# Altium project STM32F407VGT6.PrjPcb (part 2 of 2)

## Sheet MCU.SchDoc
size A3
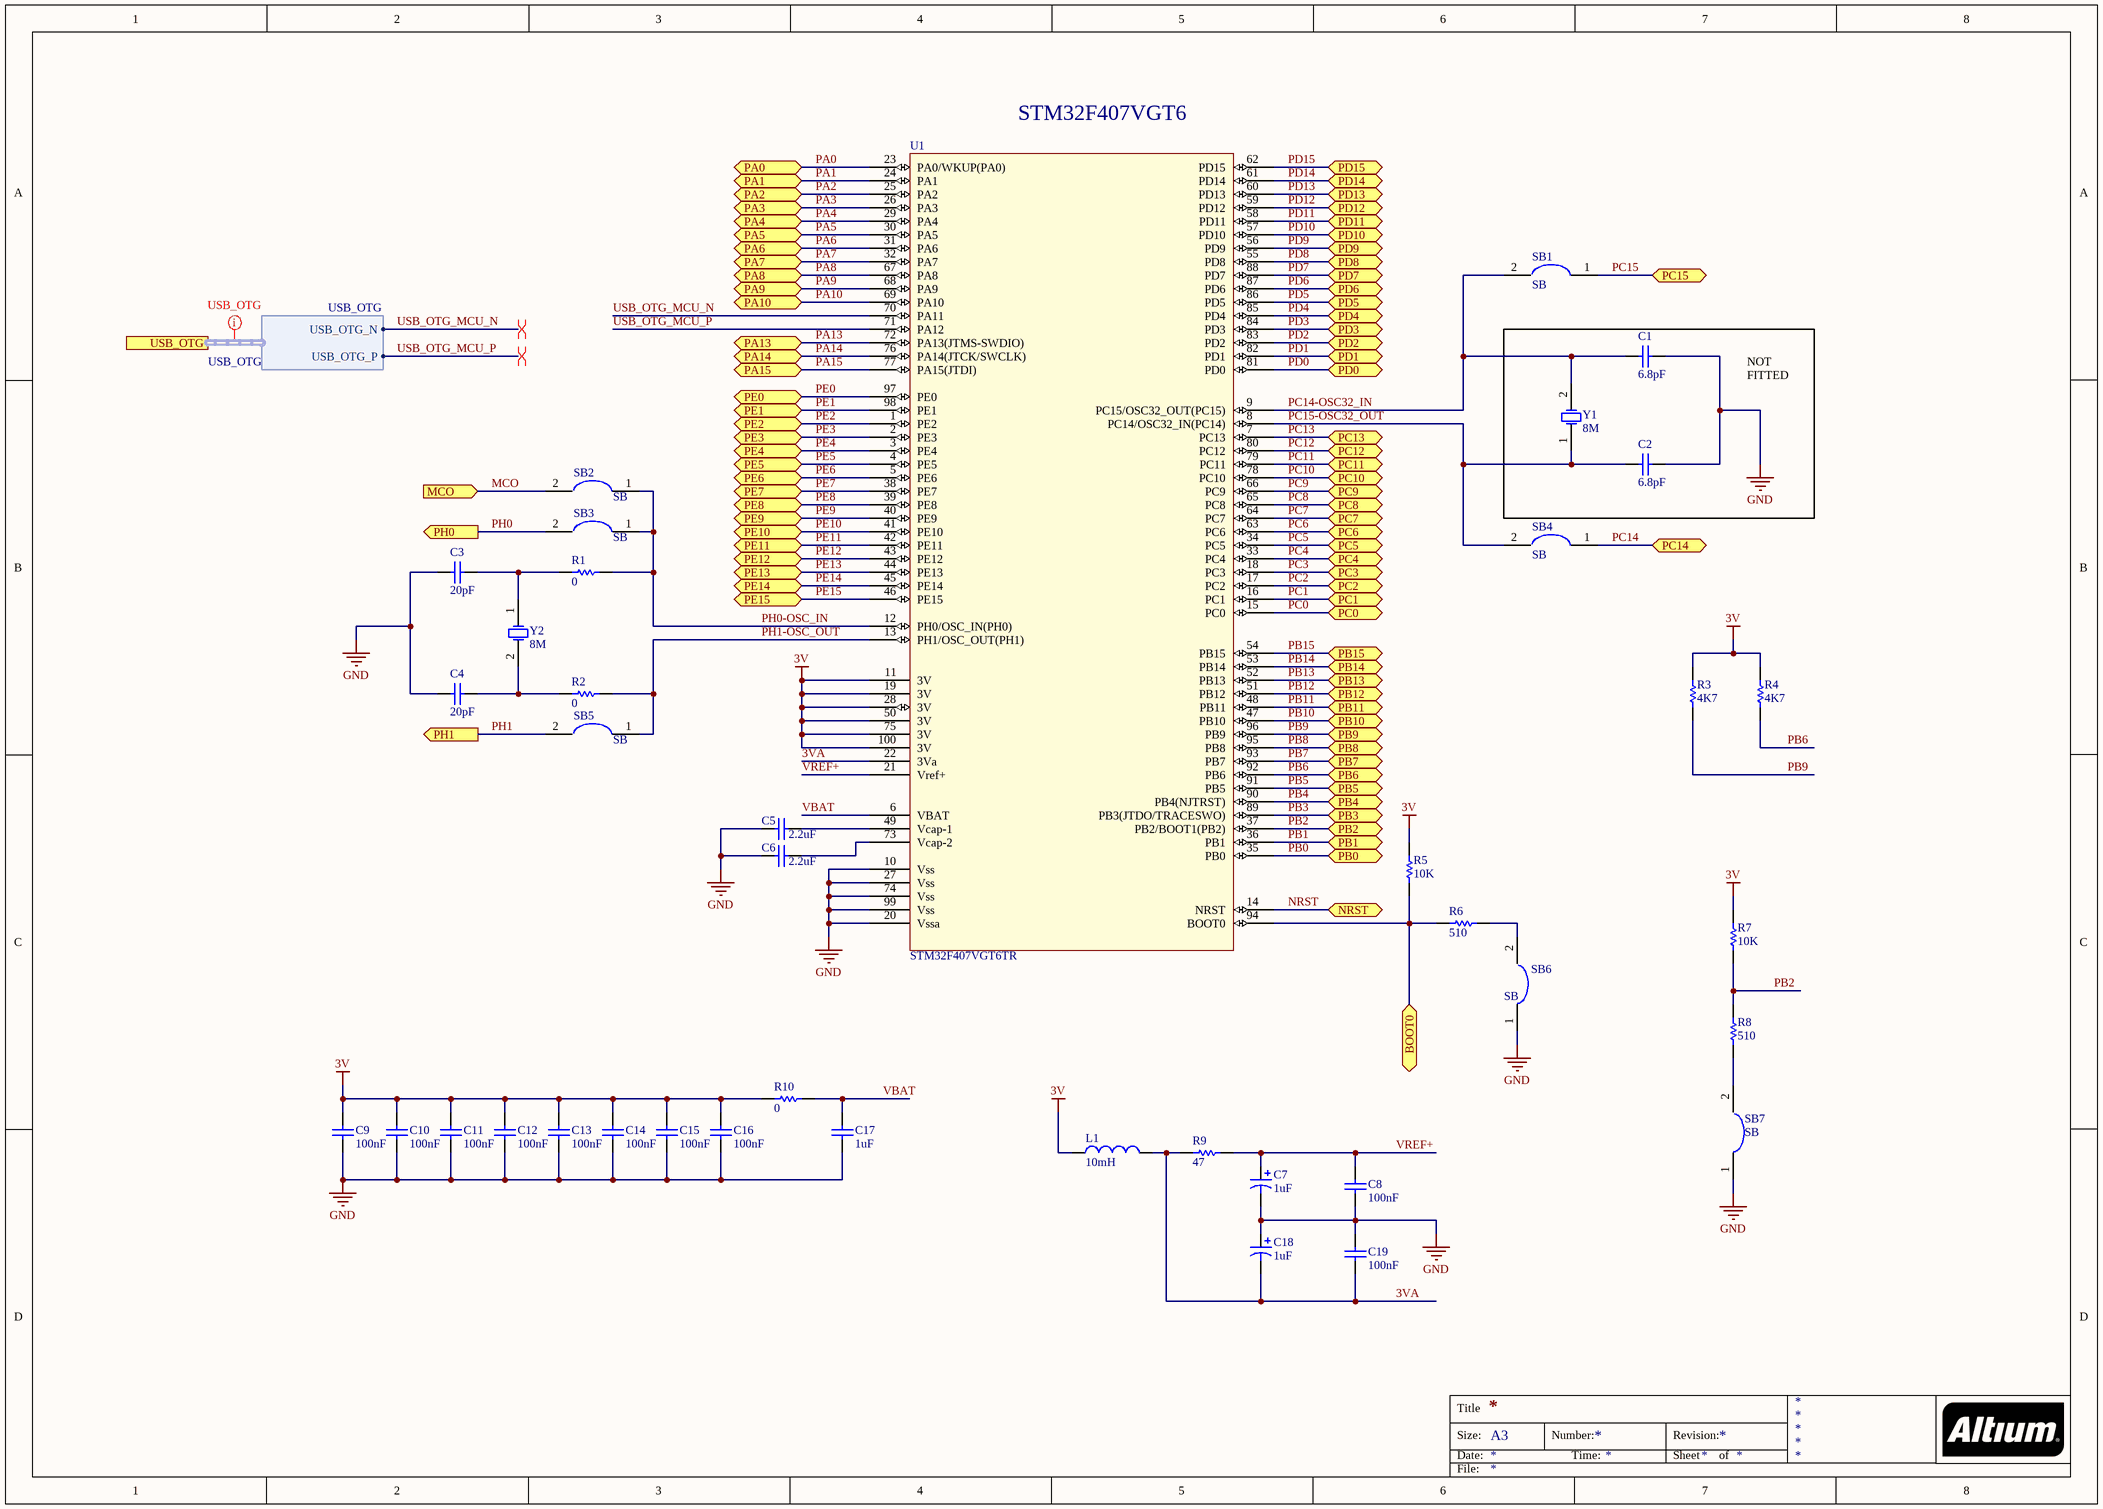
[diagram p5: MCU.SchDoc]

### Parts
C1  value 6.8pF  [CAPC0603B]  (hidden comment: Cap)
C2  value 6.8pF  [CAPC0603B]  (hidden comment: Cap)
C3  value 20pF  [CAPC0603B]  (hidden comment: Cap)
C4  value 20pF  [CAPC0603B]  (hidden comment: Cap)
C5  value 2.2uF  [CAPC0603B]  (hidden comment: Cap)
C6  value 2.2uF  [CAPC0603B]  (hidden comment: Cap)
C7  value 1uF  [TANTALUM CASE A_LEVEL B]  (hidden comment: Cap Pol1)
C8  value 100nF  [CAPC0603B]  (hidden comment: Cap)
C9  value 100nF  [CAPC0603B]  (hidden comment: Cap)
C10  value 100nF  [CAPC0603B]  (hidden comment: Cap)
C11  value 100nF  [CAPC0603B]  (hidden comment: Cap)
C12  value 100nF  [CAPC0603B]  (hidden comment: Cap)
C13  value 100nF  [CAPC0603B]  (hidden comment: Cap)
C14  value 100nF  [CAPC0603B]  (hidden comment: Cap)
C15  value 100nF  [CAPC0603B]  (hidden comment: Cap)
C16  value 100nF  [CAPC0603B]  (hidden comment: Cap)
C17  value 1uF  [CAPC0603B]  (hidden comment: Cap)
C18  value 1uF  [TANTALUM CASE A_LEVEL B]  (hidden comment: Cap Pol1)
C19  value 100nF  [CAPC0603B]  (hidden comment: Cap)
L1  value 10mH  [0402-A]  (hidden comment: Inductor)
R1  value 0  [RESC0603B]  (hidden comment: Res1)
R2  value 0  [RESC0603B]  (hidden comment: Res1)
R3  value 4K7  [RESC0402B]  (hidden comment: Res1)
R4  value 4K7  [RESC0402B]  (hidden comment: Res1)
R5  value 10K  [RESC0603B]  (hidden comment: Res1)
R6  value 510  [RESC0603B]  (hidden comment: Res1)
R7  value 10K  [RESC0603B]  (hidden comment: Res1)
R8  value 510  [RESC0603B]  (hidden comment: Res1)
R9  value 47  [RESC0603B]  (hidden comment: Res1)
R10  value 0  [RESC0603B]  (hidden comment: Res1)
SB1  SB  [SB]
SB2  SB  [SB]
SB3  SB  [SB]
SB4  SB  [SB]
SB5  SB  [SB]
SB6  SB  [SB]
SB7  SB  [SB]
U1  STM32F407VGT6TR  [LQFP100B]
Y1  8M  [HC-49S]
Y2  8M  [HC-49S]

### Ports
BOOT0 (bidir), MCO (in), NRST (bidir), PA0 (bidir), PA1 (bidir), PA2 (bidir), PA3 (bidir), PA4 (bidir), PA5 (bidir), PA6 (bidir), PA7 (bidir), PA8 (bidir), PA9 (bidir), PA10 (bidir), PA13 (bidir), PA14 (bidir), PA15 (bidir), PB0 (bidir), PB1 (bidir), PB2 (bidir), PB3 (bidir), PB4 (bidir), PB5 (bidir), PB6 (bidir), PB7 (bidir), PB8 (bidir), PB9 (bidir), PB10 (bidir), PB11 (bidir), PB12 (bidir), PB13 (bidir), PB14 (bidir), PB15 (bidir), PC0 (bidir), PC1 (bidir), PC2 (bidir), PC3 (bidir), PC4 (bidir), PC5 (bidir), PC6 (bidir), PC7 (bidir), PC8 (bidir), PC9 (bidir), PC10 (bidir), PC11 (bidir), PC12 (bidir), PC13 (bidir), PC14 (bidir), PC15 (bidir), PD0 (bidir), PD1 (bidir), PD2 (bidir), PD3 (bidir), PD4 (bidir), PD5 (bidir), PD6 (bidir), PD7 (bidir), PD8 (bidir), PD9 (bidir), PD10 (bidir), PD11 (bidir), PD12 (bidir), PD13 (bidir), PD14 (bidir), PD15 (bidir), PE0 (bidir), PE1 (bidir), PE2 (bidir), PE3 (bidir), PE4 (bidir), PE5 (bidir), PE6 (bidir), PE7 (bidir), PE8 (bidir), PE9 (bidir), PE10 (bidir), PE11 (bidir), PE12 (bidir), PE13 (bidir), PE14 (bidir), PE15 (bidir), PH0 (out), PH1 (out), USB_OTG (harness USB_OTG)

### Harnesses
USB_OTG: USB_OTG_N, USB_OTG_P

### Nets
3V: C9.2 C10.2 C11.2 C12.2 C13.2 C14.2 C15.2 C16.2 L1.1 R3.2 R4.2 R5.2 R7.2 R10.1 U1.11(3V) U1.19(3V) U1.28(3V) U1.50(3V) U1.75(3V) U1.100(3V)
GND: C1.2 C2.2 C3.1 C4.1 C5.2 C6.2 C7.2 C8.1 C9.1 C10.1 C11.1 C12.1 C13.1 C14.1 C15.1 C16.1 C17.2 C18.1 C19.2 SB6.1 SB7.1 U1.10(Vss) U1.20(Vssa) U1.27(Vss) U1.74(Vss) U1.99(Vss)
3VA: C18.2 C19.1 L1.2 R9.1 U1.22(3Va)
BOOT0: R5.1 R6.1 U1.94(BOOT0) ; port BOOT0
MCO: SB2.2 ; port MCO
NRST: U1.14(NRST) ; port NRST
PA0: U1.23(PA0/WKUP(PA0)) ; port PA0
PA1: U1.24(PA1) ; port PA1
PA2: U1.25(PA2) ; port PA2
PA3: U1.26(PA3) ; port PA3
PA4: U1.29(PA4) ; port PA4
PA5: U1.30(PA5) ; port PA5
PA6: U1.31(PA6) ; port PA6
PA7: U1.32(PA7) ; port PA7
PA8: U1.67(PA8) ; port PA8
PA9: U1.68(PA9) ; port PA9
PA10: U1.69(PA10) ; port PA10
PA13: U1.72(PA13(JTMS-SWDIO)) ; port PA13
PA14: U1.76(PA14(JTCK/SWCLK)) ; port PA14
PA15: U1.77(PA15(JTDI)) ; port PA15
PB0: U1.35(PB0) ; port PB0
PB1: U1.36(PB1) ; port PB1
PB2: R7.1 R8.1 U1.37(PB2/BOOT1(PB2)) ; port PB2
PB3: U1.89(PB3(JTDO/TRACESWO)) ; port PB3
PB4: U1.90(PB4(NJTRST)) ; port PB4
PB5: U1.91(PB5) ; port PB5
PB6: R4.1 U1.92(PB6) ; port PB6
PB7: U1.93(PB7) ; port PB7
PB8: U1.95(PB8) ; port PB8
PB9: R3.1 U1.96(PB9) ; port PB9
PB10: U1.47(PB10) ; port PB10
PB11: U1.48(PB11) ; port PB11
PB12: U1.51(PB12) ; port PB12
PB13: U1.52(PB13) ; port PB13
PB14: U1.53(PB14) ; port PB14
PB15: U1.54(PB15) ; port PB15
PC0: U1.15(PC0) ; port PC0
PC1: U1.16(PC1) ; port PC1
PC2: U1.17(PC2) ; port PC2
PC3: U1.18(PC3) ; port PC3
PC4: U1.33(PC4) ; port PC4
PC5: U1.34(PC5) ; port PC5
PC6: U1.63(PC6) ; port PC6
PC7: U1.64(PC7) ; port PC7
PC8: U1.65(PC8) ; port PC8
PC9: U1.66(PC9) ; port PC9
PC10: U1.78(PC10) ; port PC10
PC11: U1.79(PC11) ; port PC11
PC12: U1.80(PC12) ; port PC12
PC13: U1.7(PC13) ; port PC13
PC14: SB4.1 ; port PC14
PC14-OSC32_IN: C1.1 SB1.2 U1.9(PC15/OSC32_OUT(PC15)) Y1.2(OSC2)
PC15: SB1.1 ; port PC15
PC15-OSC32_OUT: C2.1 SB4.2 U1.8(PC14/OSC32_IN(PC14)) Y1.1(OSC1)
PD0: U1.81(PD0) ; port PD0
PD1: U1.82(PD1) ; port PD1
PD2: U1.83(PD2) ; port PD2
PD3: U1.84(PD3) ; port PD3
PD4: U1.85(PD4) ; port PD4
PD5: U1.86(PD5) ; port PD5
PD6: U1.87(PD6) ; port PD6
PD7: U1.88(PD7) ; port PD7
PD8: U1.55(PD8) ; port PD8
PD9: U1.56(PD9) ; port PD9
PD10: U1.57(PD10) ; port PD10
PD11: U1.58(PD11) ; port PD11
PD12: U1.59(PD12) ; port PD12
PD13: U1.60(PD13) ; port PD13
PD14: U1.61(PD14) ; port PD14
PD15: U1.62(PD15) ; port PD15
PE0: U1.97(PE0) ; port PE0
PE1: U1.98(PE1) ; port PE1
PE2: U1.1(PE2) ; port PE2
PE3: U1.2(PE3) ; port PE3
PE4: U1.3(PE4) ; port PE4
PE5: U1.4(PE5) ; port PE5
PE6: U1.5(PE6) ; port PE6
PE7: U1.38(PE7) ; port PE7
PE8: U1.39(PE8) ; port PE8
PE9: U1.40(PE9) ; port PE9
PE10: U1.41(PE10) ; port PE10
PE11: U1.42(PE11) ; port PE11
PE12: U1.43(PE12) ; port PE12
PE13: U1.44(PE13) ; port PE13
PE14: U1.45(PE14) ; port PE14
PE15: U1.46(PE15) ; port PE15
PH0: SB3.2 ; port PH0
PH0-OSC_IN: R1.2 SB2.1 SB3.1 U1.12(PH0/OSC_IN(PH0))
PH1: SB5.2 ; port PH1
PH1-OSC_OUT: R2.2 SB5.1 U1.13(PH1/OSC_OUT(PH1))
USB_OTG_MCU_N: U1.70(PA11) ; port USB_OTG.USB_OTG_N
USB_OTG_MCU_P: U1.71(PA12) ; port USB_OTG.USB_OTG_P
VBAT: C17.1 R10.2 U1.6(VBAT)
VREF+: C7.1 C8.2 R9.2 U1.21(Vref+)
NetC3_2: C3.2 R1.1 Y2.1(OSC1)
NetC4_2: C4.2 R2.1 Y2.2(OSC2)
NetC5_1: C5.1 U1.49(Vcap-1)
NetC6_1: C6.1 U1.73(Vcap-2)
NetR6_2: R6.2 SB6.2
NetR8_2: R8.2 SB7.2

### Layout directives
differential pair: USB_OTG_MCU_N, USB_OTG_MCU_P
net class USB_OTG: (no net found under the mark)

### Notes on the sheet
- (near U1) STM32F407VGT6
- NOT
- FITTED
- Title
- Size:
- Date:
- A3
- Number:
- Time:
- Revision:
- Sheet
- of
- File:

### Library data of the parts
C1 C2 = Cap_1: Capacitor; Published: 8-Jun-2000; LatestRevisionDate: 17-Jul-2002; LatestRevisionNote: Re-released for DXP Platform.; PackageReference: RAD-0.3; Publisher: Altium Limited; PackageDescription: Radial Cap, Thru-Hole; 2 Leads; 0.3 in Pin Spacing
C3 C4 = Cap: Capacitor; Published: 8-Jun-2000; LatestRevisionDate: 17-Jul-2002; LatestRevisionNote: Re-released for DXP Platform.; PackageReference: RAD-0.3; Publisher: Altium Limited; PackageDescription: Radial Cap, Thru-Hole; 2 Leads; 0.3 in Pin Spacing
C5 C6 = Cap_2: Capacitor; Published: 8-Jun-2000; LatestRevisionDate: 17-Jul-2002; LatestRevisionNote: Re-released for DXP Platform.; PackageReference: RAD-0.3; Publisher: Altium Limited; PackageDescription: Radial Cap, Thru-Hole; 2 Leads; 0.3 in Pin Spacing
C7 C18 = Cap Pol1: Polarized Capacitor (Radial); Published: 8-Jun-2000; LatestRevisionDate: 17-Jul-2002; LatestRevisionNote: Re-released for DXP Platform.; PackageReference: RB7.6-15; Publisher: Altium Limited; PackageDescription: Polarized Capacitor (Radial); 2 Leads
C8-C16 C19 = Cap_3: Capacitor; Published: 8-Jun-2000; LatestRevisionDate: 17-Jul-2002; LatestRevisionNote: Re-released for DXP Platform.; PackageReference: RAD-0.3; Publisher: Altium Limited; PackageDescription: Radial Cap, Thru-Hole; 2 Leads; 0.3 in Pin Spacing
C17 = Cap_4: Capacitor; Published: 8-Jun-2000; LatestRevisionDate: 17-Jul-2002; LatestRevisionNote: Re-released for DXP Platform.; PackageReference: RAD-0.3; Publisher: Altium Limited; PackageDescription: Radial Cap, Thru-Hole; 2 Leads; 0.3 in Pin Spacing
L1 = Inductor: Code_IEC: 1005; Published: 8-Jun-2000; LatestRevisionDate: 29-May-2009; LatestRevisionNote: IPC-7351 Footprint Added.; PackageReference: 0402-A; Publisher: Altium Limited; PackageDescription: Chip Inductor; Code_JEITA: 0402
R1 R2 R10 = Res1: Resistor; Published: 8-Jun-2000; LatestRevisionDate: 17-Jul-2002; LatestRevisionNote: Re-released for DXP Platform.; PackageReference: AXIAL-0.3; Publisher: Altium Limited; PackageDescription: Axial Device, Thru-Hole; 2 Leads; 0.3 in Pin Spacing
R3 R4 = Res1_16: Resistor; Published: 8-Jun-2000; LatestRevisionDate: 17-Jul-2002; LatestRevisionNote: Re-released for DXP Platform.; PackageReference: AXIAL-0.3; Publisher: Altium Limited; PackageDescription: Axial Device, Thru-Hole; 2 Leads; 0.3 in Pin Spacing
R5 R7 = Res1_2: Resistor; Published: 8-Jun-2000; LatestRevisionDate: 17-Jul-2002; LatestRevisionNote: Re-released for DXP Platform.; PackageReference: AXIAL-0.3; Publisher: Altium Limited; PackageDescription: Axial Device, Thru-Hole; 2 Leads; 0.3 in Pin Spacing
R6 R8 = Res1_1: Resistor; Published: 8-Jun-2000; LatestRevisionDate: 17-Jul-2002; LatestRevisionNote: Re-released for DXP Platform.; PackageReference: AXIAL-0.3; Publisher: Altium Limited; PackageDescription: Axial Device, Thru-Hole; 2 Leads; 0.3 in Pin Spacing
R9 = Res1_3: Resistor; Published: 8-Jun-2000; LatestRevisionDate: 17-Jul-2002; LatestRevisionNote: Re-released for DXP Platform.; PackageReference: AXIAL-0.3; Publisher: Altium Limited; PackageDescription: Axial Device, Thru-Hole; 2 Leads; 0.3 in Pin Spacing
U1 = STM32F407VGT6TR: STMICROELECTRONICS - STM32F407VGT6TR - MCU, 32BIT, CORTEX-M4, 168MHZ, LQFP-100; Architecture: ARM Cortex-M4; CPU Speed: 168; Program Memory Size: 1; RAM Memory Size: 192; No. of Pins: 100; MCU Case Style: LQFP; No. of I/O's: 82; Embedded Interface Type: CAN, I2; Supply Voltage Min: 1.8; Supply Voltage Max: 3.6; Product Range: STM32 F4 ARM Cortex-M4 Microcontrollers; SVHC: No SVHC (17-Dec-2015); Controller Family/Series: STM32; MPU Core Size: 32; Peripherals: ADC, DAC, RTC; Supplier 1: Farnell; Manufacturer: STMICROELECTRONICS; Manufacturer Part Number: STM32F407VGT6TR; RoHS: YES; Stock 1: 521; Pricing 1: 1=9.65, 10=8.36, 25=8.02, 50=7.59, 100=7.06, 250=6.62, 500=6.19, 1000=5.76 (GBP); Packaging: Cut Tape; Automotive Qualification Standard: -; MSL: MSL 3 - 168 hours; Operating Temperature Max: 85; Operating Temperature Min: -40; ComponentLink1URL: http://www.farnell.com/datasheets/1994630.pdf; ComponentLink1Description: http://www.farnell.com/datasheets/1994630.pdf; ComponentLink2URL: http://www.farnell.com/datasheets/2042748.pdf; ComponentLink2Description: http://www.farnell.com/datasheets/2042748.pdf; Supplier Part Number 1: 2333297
Y1 Y2 = XTAL: Crystal Oscillator; Published: 8-Jun-2000; LatestRevisionDate: 17-Jul-2002; LatestRevisionNote: Re-released for DXP Platform.; PackageReference: R38; Publisher: Altium Limited; PackageDescription: Crystal, Thru-Hole; 2 Leads; Body 3.1 x 8.2 mm (Dia.xH)

## Sheet PERIPHERALS.SchDoc
size A4
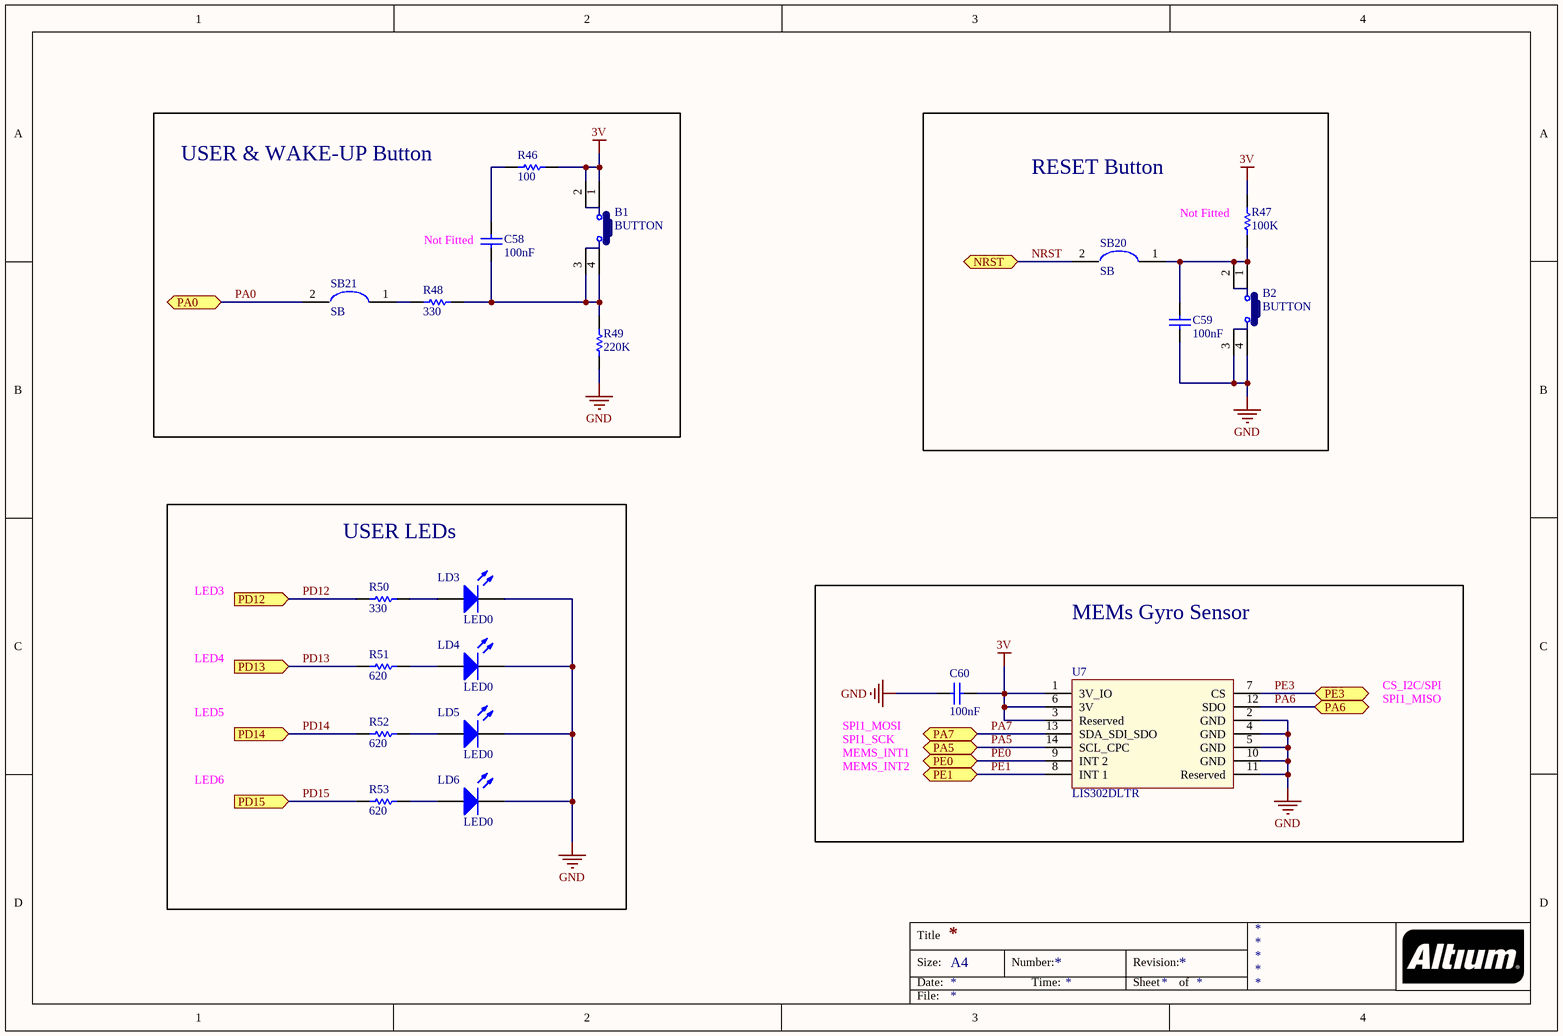
[diagram p6: PERIPHERALS.SchDoc]

### Parts
B1  BUTTON  [TL3301PF160QG]
B2  BUTTON  [TL3301PF160QG]
C58  value 100nF  [CAPC0603B]  (hidden comment: Cap)
C59  value 100nF  [CAPC0603B]  (hidden comment: Cap)
C60  value 100nF  [CAPC0603B]  (hidden comment: Cap)
LD3  LED0  [LED_0603]
LD4  LED0  [LED_0603]
LD5  LED0  [LED_0603]
LD6  LED0  [LED_0603]
R46  value 100  [RESC0402B]  (hidden comment: Res1)
R47  value 100K  [RESC0402B]  (hidden comment: Res1)
R48  value 330  [RESC0402B]  (hidden comment: Res1)
R49  value 220K  [RESC0603B]  (hidden comment: Res1)
R50  value 330  [RESC0402B]  (hidden comment: Res1)
R51  value 620  [RESC0402B]  (hidden comment: Res1)
R52  value 620  [RESC0402B]  (hidden comment: Res1)
R53  value 620  [RESC0402B]  (hidden comment: Res1)
SB20  SB  [SB]
SB21  SB  [SB]
U7  LIS302DLTR  [LIS302DLTR]

### Blocks framed on the sheet
USER & WAKE-UP Button: B1 C58 R46 R48 R49 SB21
RESET Button: B2 C59 R47 SB20
USER LEDs: LD3-LD6 R50-R53
MEMs Gyro Sensor: C60 U7

### Ports
NRST (bidir), PA0 (bidir), PA5 (bidir), PA6 (bidir), PA7 (bidir), PD12 (in), PD13 (in), PD14 (in), PD15 (in), PE0 (bidir), PE1 (bidir), PE3 (bidir)

### Nets
3V: B1.1 B1.2 C60.2 R46.1 R47.1 U7.1(3V_IO) U7.3(Reserved) U7.6(3V)
GND: B2.3 B2.4 C59.2 C60.1 LD3.2(K) LD4.2(K) LD5.2(K) LD6.2(K) R49.1 U7.2(GND) U7.4(GND) U7.5(GND) U7.10(GND) U7.11(Reserved)
NRST: SB20.2 ; port NRST
PA0: SB21.2 ; port PA0
PA5: U7.14(SCL_CPC) ; port PA5
PA6: U7.12(SDO) ; port PA6
PA7: U7.13(SDA_SDI_SDO) ; port PA7
PD12: R50.1 ; port PD12
PD13: R51.1 ; port PD13
PD14: R52.1 ; port PD14
PD15: R53.1 ; port PD15
PE0: U7.9(INT_2) ; port PE0
PE1: U7.8(INT_1) ; port PE1
PE3: U7.7(CS) ; port PE3
NetB1_3: B1.3 B1.4 C58.1 R48.2 R49.2
NetB2_1: B2.1 B2.2 C59.1 R47.2 SB20.1
NetC58_2: C58.2 R46.2
NetLD3_1: LD3.1(A) R50.2
NetLD4_1: LD4.1(A) R51.2
NetLD5_1: LD5.1(A) R52.2
NetLD6_1: LD6.1(A) R53.2
NetR48_1: R48.1 SB21.1

### Notes on the sheet
- (near C58) Not Fitted
- (near R47) Not Fitted
- LED3
- LED4
- LED5
- CS_I2C/SPI
- SPI1_MISO
- LED6
- SPI1_MOSI
- SPI1_SCK
- MEMS_INT1
- MEMS_INT2
- Title
- Size:
- Date:
- A4
- Number:
- Time:
- Revision:
- Sheet
- of
- File:

### Library data of the parts
B1 B2 = BUTTON: Manufacturer: TE Connectivity (Tyco Electronics); Manufacturer Part Number: 4-1437565-9; Actuator Length: 3.4 mm; Body Orientation: Straight; Actuator Style: Round Button; Electrical Life: 100000 Cycle; Dielectric Strength: 500 VAC; Contact Rating @ Voltage: 0.05@12VDC A; Maximum DC Voltage Rating: 12 V; Illumination Type: N/R; Maximum Contact Resistance: 100 mOhm; Operating Force: 1.57 N; Actuation Force: 1.6 N; Supplier 1: RSComponents; Stock 1: 850; Actuator Color: N/A; Contact Material: Copper Alloy; Base Material: N/A; Family: FSMJSMA; Contact Plating: Silver; Ground Terminal: N/A; Housing Material: N/A; Dimension: 6 x 10 x 7.25 mm; Part No: 4-1437565-9; RoHS: Yes; Maximum AC Voltage Rating: N/A; Seal Description: N/A; Pole Throw Configuration: N/A; Mechanical Life: N/A; Packaging: Bulk; Product Weight: N/A; Mounting: Surface Mount,Gull Wing; Minimum Insulation Resistance: 100 MOhm; Operating Temperature: -20 to 85 C; Type: N/A; Switch Configuration: N/A; Seal Location: N/A; ComponentLink1URL: https://datasheet.ciiva.com/8164/eng-cs-1308111-1-switches-core-program-catalog-0308-8164805.pdf; ComponentLink1Description: https://datasheet.ciiva.com/8164/eng-cs-1308111-1-switches-core-program-catalog-0308-8164805.pdf; ComponentLink2URL: https://datasheet.ciiva.com/8082/eng-cs-1308111-1-switches-core-program-catalog-0308-8082679.pdf; ComponentLink2Description: https://datasheet.ciiva.com/8082/eng-cs-1308111-1-switches-core-program-catalog-0308-8082679.pdf; ComponentLink3URL: https://datasheet.ciiva.com/16535/eng-cs-1308111-1-switches-core-program-catalog-0308-16535272.pdf; ComponentLink3Description: https://datasheet.ciiva.com/16535/eng-cs-1308111-1-switches-core-program-catalog-0308-16535272.pdf; Supplier 2: Mouser; Stock 2: 6488; Pricing 2: 1=0.39, 10=0.381, 50=0.354, 100=0.34, 1000=0.272, 10000=0.204 (USD); Size: 6 x 6 mm; Termination Style: Gull Wing; ComponentLink4URL: https://datasheet.ciiva.com/16156/p010593-16156341.pdf; ComponentLink4Description: https://datasheet.ciiva.com/16156/p010593-16156341.pdf; ComponentLink5URL: https://datasheet.ciiva.com/2900/tl3301-2900813.pdf; ComponentLink5Description: https://datasheet.ciiva.com/2900/tl3301-2900813.pdf; ComponentLink6URL: https://datasheet.ciiva.com/2900/tl3301-2900814.pdf; ComponentLink6Description: https://datasheet.ciiva.com/2900/tl3301-2900814.pdf; ComponentLink7URL: https://datasheet.ciiva.com/2900/tl3301-2900815.pdf; ComponentLink7Description: https://datasheet.ciiva.com/2900/tl3301-2900815.pdf
C58-C60 = Cap_3: Capacitor; Published: 8-Jun-2000; LatestRevisionDate: 17-Jul-2002; LatestRevisionNote: Re-released for DXP Platform.; PackageReference: RAD-0.3; Publisher: Altium Limited; PackageDescription: Radial Cap, Thru-Hole; 2 Leads; 0.3 in Pin Spacing
LD3-LD6 = LED0: Typical INFRARED GaAs LED; Published: 8-Jun-2000; LatestRevisionDate: 08-Jul-2005; LatestRevisionNote: Mech Layer 1 removed.; PackageReference: LED-0; Publisher: Altium Limited; PackageDescription: LED; 2 Leads
R46 = Res1_4: Resistor; Published: 8-Jun-2000; LatestRevisionDate: 17-Jul-2002; LatestRevisionNote: Re-released for DXP Platform.; PackageReference: AXIAL-0.3; Publisher: Altium Limited; PackageDescription: Axial Device, Thru-Hole; 2 Leads; 0.3 in Pin Spacing
R47 = Res1_5: Resistor; Published: 8-Jun-2000; LatestRevisionDate: 17-Jul-2002; LatestRevisionNote: Re-released for DXP Platform.; PackageReference: AXIAL-0.3; Publisher: Altium Limited; PackageDescription: Axial Device, Thru-Hole; 2 Leads; 0.3 in Pin Spacing
R48 R50 = Res1_12: Resistor; Published: 8-Jun-2000; LatestRevisionDate: 17-Jul-2002; LatestRevisionNote: Re-released for DXP Platform.; PackageReference: AXIAL-0.3; Publisher: Altium Limited; PackageDescription: Axial Device, Thru-Hole; 2 Leads; 0.3 in Pin Spacing
R49 = Res1_14: Resistor; Published: 8-Jun-2000; LatestRevisionDate: 17-Jul-2002; LatestRevisionNote: Re-released for DXP Platform.; PackageReference: AXIAL-0.3; Publisher: Altium Limited; PackageDescription: Axial Device, Thru-Hole; 2 Leads; 0.3 in Pin Spacing
R51-R53 = Res1_10: Resistor; Published: 8-Jun-2000; LatestRevisionDate: 17-Jul-2002; LatestRevisionNote: Re-released for DXP Platform.; PackageReference: AXIAL-0.3; Publisher: Altium Limited; PackageDescription: Axial Device, Thru-Hole; 2 Leads; 0.3 in Pin Spacing
U7 = LIS302DLTR: Manufacturer: STMicroelectronics; Other Related Documents: LIS302DL View All Specifications; EDA / CAD Models: Download from Accelerated Designs; Axis: X, Y, Z; Acceleration Range: ±2.3g, 9.2g; Sensitivity: 18mg/digit, 72mg/digit; Voltage - Supply: 2.16 V ~ 3.6 V; Output Type: Digital; Bandwidth: 100Hz ~ 400Hz Selectable; Interface: I²C, SPI; Online Catalog: MEMS "piccolo" LIS302DL, LIS352AR and LIS352AX; For Use With: 497-6342-ND  - BOARD EVALUATION FOR LIS302DL 497-6227-ND  - BOARD ADAPTER 20DIP LIS3LV02DL 497-8204-ND  - BOARD ADAPTER LIS302SG DIL24 497-8373-ND  - BOARD EVAL EXTENSION SN250 497-6226-ND  - BOARD EVAL ACCELEROM LIS3LV02DL 497-6246-ND  - BOARD EVAL ACCELEROM LIS302ALK 497-8203-ND  - BOARD DEMO LIS302SG 497-9047-ND  - BOARD DEMO ACCELEROMETER DIL24; Other Names: 497-5911-2; Supplier 1: Digikey; Manufacturer Part Number: LIS302DLTR; Stock 1: 0; Pricing 1: 1=2.99, 10=2.682, 100=2.1973, 500=1.8705 (USD); Standard Package: 5,000; Category: Sensors, Transducers; Family: Accelerometers; Series: MEMS, piccolo; Packaging: Tape & Reel (TR); Mounting Type: Surface Mount; Package / Case: 14-VFLGA; Supplier Device Package: 14-LGA (3x5); ComponentLink1URL: https://datasheet.ciiva.com/2809/cd00135460-2809829.pdf; ComponentLink1Description: https://datasheet.ciiva.com/2809/cd00135460-2809829.pdf; ComponentLink2URL: https://datasheet.ciiva.com/5296/cd00135460-98938-5296661.pdf; ComponentLink2Description: https://datasheet.ciiva.com/5296/cd00135460-98938-5296661.pdf; ComponentLink3URL: https://datasheet.ciiva.com/2809/cd00135460-2809830.pdf; ComponentLink3Description: https://datasheet.ciiva.com/2809/cd00135460-2809830.pdf; ComponentLink4URL: https://datasheet.ciiva.com/2809/cd00135460-2809831.pdf; ComponentLink4Description: https://datasheet.ciiva.com/2809/cd00135460-2809831.pdf; ComponentLink5URL: https://datasheet.ciiva.com/3271/cd00135460-3271564.pdf; ComponentLink5Description: https://datasheet.ciiva.com/3271/cd00135460-3271564.pdf; ComponentLink6URL: https://datasheet.ciiva.com/26928/lis302dltr-26928596.pdf; ComponentLink6Description: https://datasheet.ciiva.com/26928/lis302dltr-26928596.pdf

## Nets that join several sheets
2V5: AUDIO (7 pins), ST_LINK_SWD (C30.2 C31.2 U3.5)
3V: Main (5 pins), AUDIO (10 pins), ST_LINK_SWD (16 pins), USB_OTG_FS (R54.2 R55.2 R56.2 R59.2), MCU (20 pins), PERIPHERALS (8 pins)
5V: Main (P2.3 P2.4), ST_LINK_SWD (9 pins), USB_OTG_FS (U8.4)
GND: Main (10 pins), AUDIO (29 pins), ST_LINK_SWD (42 pins), USB_OTG_FS (7 pins), MCU (26 pins), PERIPHERALS (14 pins)
BOOT0: Main (P2.21), MCU (R5.1 R6.1 U1.94)
MCO: ST_LINK_SWD (C21.2 R17.2), MCU (SB2.2)
NRST: Main (P1.6), ST_LINK_SWD (SB9.1), MCU (U1.14), PERIPHERALS (SB20.2)
PA0: Main (P1.12), MCU (U1.23), PERIPHERALS (SB21.2)
PA1: Main (P1.11), MCU (U1.24)
PA2: Main (P1.14), MCU (U1.25)
PA3: Main (P1.13), MCU (U1.26)
PA4: Main (P1.16), AUDIO (R36.2 U5.40), MCU (U1.29)
PA5: Main (P1.15), MCU (U1.30), PERIPHERALS (U7.14)
PA6: Main (P1.18), MCU (U1.31), PERIPHERALS (U7.12)
PA7: Main (P1.17), MCU (U1.32), PERIPHERALS (U7.13)
PA8: Main (P2.43), MCU (U1.67)
PA9: Main (P2.44), USB_OTG_FS (5 pins), MCU (U1.68)
PA10: Main (P2.41), USB_OTG_FS (R62.2), MCU (U1.69)
PA13: Main (P2.42), ST_LINK_SWD (SB17.2), MCU (U1.72)
PA14: Main (P2.39), ST_LINK_SWD (SB13.2), MCU (U1.76)
PA15: Main (P2.40), MCU (U1.77)
PB0: Main (P1.22), MCU (U1.35)
PB1: Main (P1.21), MCU (U1.36)
PB2: Main (P1.24), MCU (R7.1 R8.1 U1.37)
PB3: Main (P2.28), ST_LINK_SWD (SB10.1), MCU (U1.89)
PB4: Main (P2.25), MCU (U1.90)
PB5: Main (P2.26), MCU (U1.91)
PB6: Main (P2.23), AUDIO (U5.2), MCU (R4.1 U1.92)
PB7: Main (P2.24), MCU (U1.93)
PB8: Main (P2.19), MCU (U1.95)
PB9: Main (P2.20), AUDIO (U5.1), MCU (R3.1 U1.96)
PB10: Main (P1.34), AUDIO (U6.4), MCU (U1.47)
PB11: Main (P1.35), MCU (U1.48)
PB12: Main (P1.36), MCU (U1.51)
PB13: Main (P1.37), MCU (U1.52)
PB14: Main (P1.38), MCU (U1.53)
PB15: Main (P1.39), MCU (U1.54)
PC0: Main (P1.8), USB_OTG_FS (R58.2), MCU (U1.15)
PC1: Main (P1.7), MCU (U1.16)
PC2: Main (P1.10), MCU (U1.17)
PC3: Main (P1.9), AUDIO (R41.2 U6.5), MCU (U1.18)
PC4: Main (P1.20), AUDIO (R42.2), MCU (U1.33)
PC5: Main (P1.19), MCU (U1.34)
PC6: Main (P2.47), MCU (U1.63)
PC7: Main (P2.48), AUDIO (U5.37), MCU (U1.64)
PC8: Main (P2.45), MCU (U1.65)
PC9: Main (P2.46), MCU (U1.66)
PC10: Main (P2.37), AUDIO (U5.38), MCU (U1.78)
PC11: Main (P2.38), MCU (U1.79)
PC12: Main (P2.35), AUDIO (U5.39), MCU (U1.80)
PC13: Main (P2.12), MCU (U1.7)
PC14: Main (P2.9), MCU (SB4.1)
PC15: Main (P2.10), MCU (SB1.1)
PD0: Main (P2.36), MCU (U1.81)
PD1: Main (P2.33), MCU (U1.82)
PD2: Main (P2.34), MCU (U1.83)
PD3: Main (P2.31), MCU (U1.84)
PD4: Main (P2.32), AUDIO (R43.2 U5.32), MCU (U1.85)
PD5: Main (P2.29), USB_OTG_FS (R57.2), MCU (U1.86)
PD6: Main (P2.30), MCU (U1.87)
PD7: Main (P2.27), MCU (U1.88)
PD8: Main (P1.40), MCU (U1.55)
PD9: Main (P1.41), MCU (U1.56)
PD10: Main (P1.42), MCU (U1.57)
PD11: Main (P1.43), MCU (U1.58)
PD12: Main (P1.44), MCU (U1.59), PERIPHERALS (R50.1)
PD13: Main (P1.45), MCU (U1.60), PERIPHERALS (R51.1)
PD14: Main (P1.46), MCU (U1.61), PERIPHERALS (R52.1)
PD15: Main (P1.47), MCU (U1.62), PERIPHERALS (R53.1)
PE0: Main (P2.17), MCU (U1.97), PERIPHERALS (U7.9)
PE1: Main (P2.18), MCU (U1.98), PERIPHERALS (U7.8)
PE2: Main (P2.15), MCU (U1.1)
PE3: Main (P2.16), MCU (U1.2), PERIPHERALS (U7.7)
PE4: Main (P2.13), MCU (U1.3)
PE5: Main (P2.14), MCU (U1.4)
PE6: Main (P2.11), MCU (U1.5)
PE7: Main (P1.25), MCU (U1.38)
PE8: Main (P1.26), MCU (U1.39)
PE9: Main (P1.27), MCU (U1.40)
PE10: Main (P1.28), MCU (U1.41)
PE11: Main (P1.29), MCU (U1.42)
PE12: Main (P1.30), MCU (U1.43)
PE13: Main (P1.31), MCU (U1.44)
PE14: Main (P1.32), MCU (U1.45)
PE15: Main (P1.33), MCU (U1.46)
PH0: Main (P2.7), MCU (SB3.2)
PH1: Main (P2.8), MCU (SB5.2)
USB_OTG_MCU_N: USB_OTG_FS (R60.2 U9.D3), MCU (U1.70)
USB_OTG_MCU_P: USB_OTG_FS (R61.2 U9.C3), MCU (U1.71)